# EAGLE design lens controller2 (EAGLE 6.2)
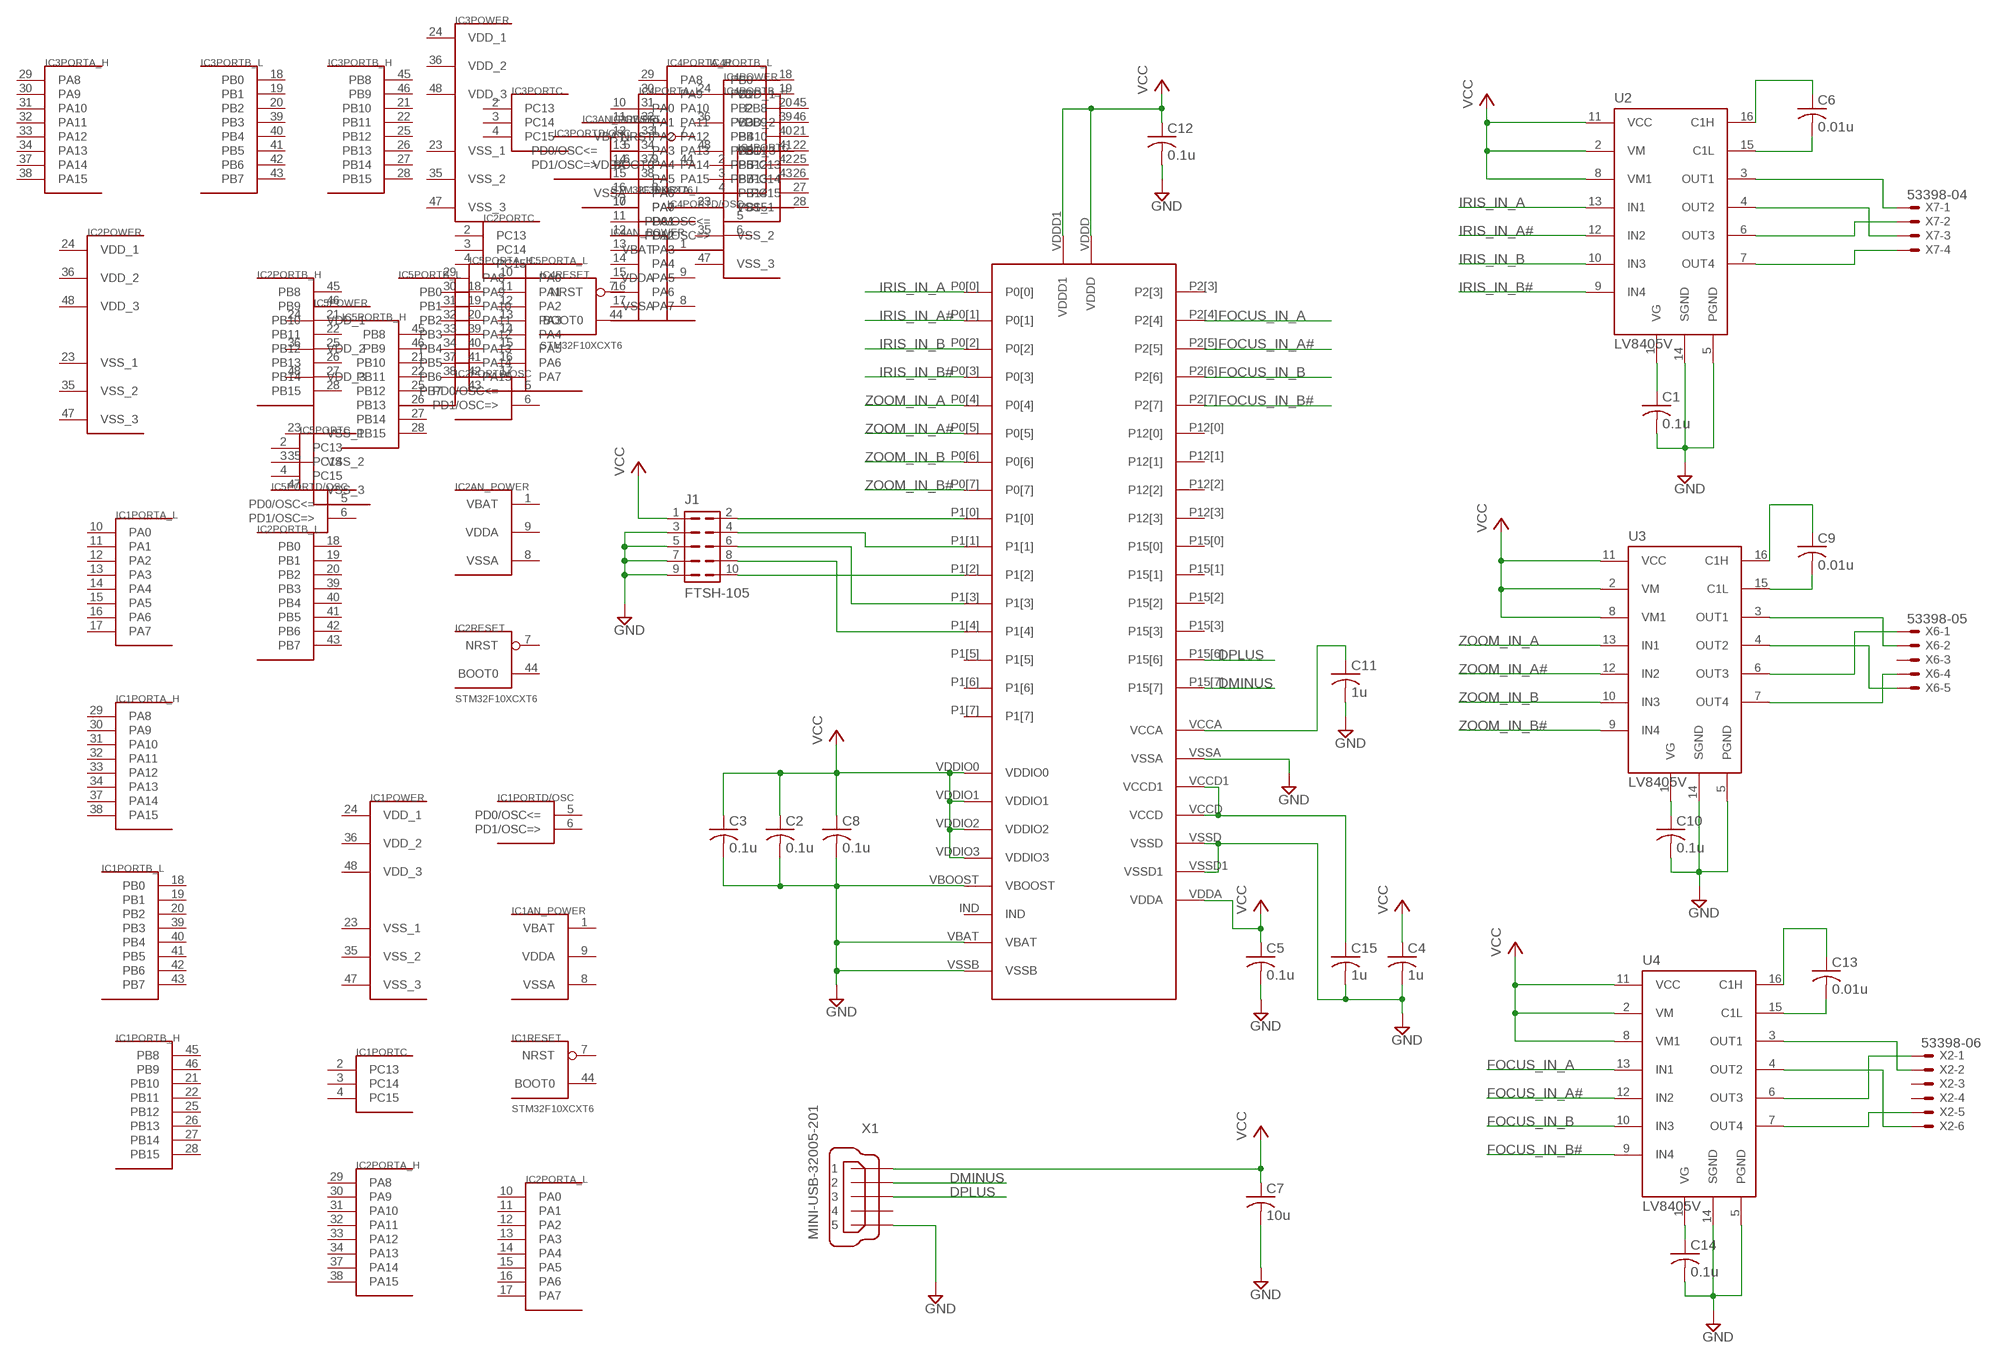
[diagram p0: schematic, sheet 1]

## Parts
C1  0.1u  C-USC1206  [C1206]
C2  0.1u  C-USC1206  [C1206]
C3  0.1u  C-USC1206  [C1206]
C4  1u  C-USC1206  [C1206]
C5  0.1u  C-USC1206  [C1206]
C6  0.01u  C-USC1206  [C1206]
C7  10u  C-USC1206  [C1206]
C8  0.1u  C-USC1206  [C1206]
C9  0.01u  C-USC1206  [C1206]
C10  0.1u  C-USC1206  [C1206]
C11  1u  C-USC1206  [C1206]
C12  0.1u  C-USC1206  [C1206]
C13  0.01u  C-USC1206  [C1206]
C14  0.1u  C-USC1206  [C1206]
C15  1u  C-USC1206  [C1206]
IC1  STM32F10XCXT6  [TQFP48]
IC2  STM32F10XCXT6  [TQFP48]
IC3  STM32F10XCXT6  [TQFP48]
IC4  STM32F10XCXT6  [TQFP48]
IC5  STM32F10XCXT6  [TQFP48]
J1  FTSH-105  [FTSH-105-01-XXX-DV-K]
U1  CY8C3XXX_48QFN  [48QFN]
U2  LV8405V  [SSOP16]
U3  LV8405V  [SSOP16]
U4  LV8405V  [SSOP16]
X1  MINI-USB-32005-201  [32005-201]
X2  53398-06  [53398-06]
X6  53398-05  [53398-05]
X7  53398-04  [53398-04]

## Nets
DMINUS: U1.P15[7] X1.2
DPLUS: U1.P15[6] X1.3
FOCUS_IN_A: U1.P2[4] U4.13(IN1)
FOCUS_IN_A#: U1.P2[5] U4.12(IN2)
FOCUS_IN_B: U1.P2[6] U4.10(IN3)
FOCUS_IN_B#: U1.P2[7] U4.9(IN4)
GND: C1.2 C2.2 C3.2 C4.2 C5.2 C7.2 C8.2 C10.2 C11.2 C12.2 C14.2 C15.2 J1.3 J1.5 J1.7 J1.9 U1.VBAT U1.VBOOST U1.VSSA U1.VSSB U1.VSSD U1.VSSD1 U2.5(PGND) U2.14(SGND) U3.5(PGND) U3.14(SGND) U4.5(PGND) U4.14(SGND) X1.5
IRIS_IN_A: U1.P0[0] U2.13(IN1)
IRIS_IN_A#: U1.P0[1] U2.12(IN2)
IRIS_IN_B: U1.P0[2] U2.10(IN3)
IRIS_IN_B#: U1.P0[3] U2.9(IN4)
N$1: J1.2 U1.P1[0]
N$2: J1.4 U1.P1[1]
N$3: J1.10 U1.P1[2]
N$4: J1.6 U1.P1[3]
N$5: J1.8 U1.P1[4]
N$6: C11.1 U1.VCCA
N$7: C6.2 U2.15(C1L)
N$8: C6.1 U2.16(C1H)
N$9: C1.1 U2.1(VG)
N$10: C9.2 U3.15(C1L)
N$11: C9.1 U3.16(C1H)
N$12: C10.1 U3.1(VG)
N$13: U2.3(OUT1) X7.1
N$14: U2.4(OUT2) X7.3
N$15: C13.2 U4.15(C1L)
N$16: C13.1 U4.16(C1H)
N$17: C14.1 U4.1(VG)
N$18: U2.6(OUT3) X7.2
N$19: U2.7(OUT4) X7.4
N$20: U3.3(OUT1) X6.2
N$21: U3.4(OUT2) X6.5
N$22: U3.6(OUT3) X6.1
N$23: U3.7(OUT4) X6.4
N$24: U4.3(OUT1) X2.2
N$25: U4.4(OUT2) X2.6
N$26: U4.6(OUT3) X2.1
N$27: U4.7(OUT4) X2.5
N$28: C15.1 U1.VCCD U1.VCCD1
N$29: IC3.10(PORTA_L:PA0) IC4.17(PORTA_L:PA7)
N$30: IC3.5(PORTD/OSC:PD0/OSC<=) IC4.34(PORTA_H:PA13)
N$31: IC3.6(PORTD/OSC:PD1/OSC=>) IC4.37(PORTA_H:PA14)
VCC: C2.1 C3.1 C4.1 C5.1 C7.1 C8.1 C12.1 J1.1 U1.VDDA U1.VDDD U1.VDDD1 U1.VDDIO0 U1.VDDIO1 U1.VDDIO2 U1.VDDIO3 U2.2(VM) U2.8(VM1) U2.11(VCC) U3.2(VM) U3.8(VM1) U3.11(VCC) U4.2(VM) U4.8(VM1) U4.11(VCC) X1.1
ZOOM_IN_A: U1.P0[4] U3.13(IN1)
ZOOM_IN_A#: U1.P0[5] U3.12(IN2)
ZOOM_IN_B: U1.P0[6] U3.10(IN3)
ZOOM_IN_B#: U1.P0[7] U3.9(IN4)
Unconnected: IC1.2(PORTC:PC13) IC1.3(PORTC:PC14) IC1.4(PORTC:PC15) IC1.5(PORTD/OSC:PD0/OSC<=) IC1.6(PORTD/OSC:PD1/OSC=>) IC1.7(RESET:NRST) IC1.10(PORTA_L:PA0) IC1.11(PORTA_L:PA1) IC1.12(PORTA_L:PA2) IC1.13(PORTA_L:PA3) IC1.14(PORTA_L:PA4) IC1.15(PORTA_L:PA5) IC1.16(PORTA_L:PA6) IC1.17(PORTA_L:PA7) IC1.18(PORTB_L:PB0) IC1.19(PORTB_L:PB1) IC1.20(PORTB_L:PB2) IC1.21(PORTB_H:PB10) IC1.22(PORTB_H:PB11) IC1.25(PORTB_H:PB12) IC1.26(PORTB_H:PB13) IC1.27(PORTB_H:PB14) IC1.28(PORTB_H:PB15) IC1.29(PORTA_H:PA8) IC1.30(PORTA_H:PA9) IC1.31(PORTA_H:PA10) IC1.32(PORTA_H:PA11) IC1.33(PORTA_H:PA12) IC1.34(PORTA_H:PA13) IC1.37(PORTA_H:PA14) IC1.38(PORTA_H:PA15) IC1.39(PORTB_L:PB3) IC1.40(PORTB_L:PB4) IC1.41(PORTB_L:PB5) IC1.42(PORTB_L:PB6) IC1.43(PORTB_L:PB7) IC1.44(RESET:BOOT0) IC1.45(PORTB_H:PB8) IC1.46(PORTB_H:PB9) IC2.2(PORTC:PC13) IC2.3(PORTC:PC14) IC2.4(PORTC:PC15) IC2.5(PORTD/OSC:PD0/OSC<=) IC2.6(PORTD/OSC:PD1/OSC=>) IC2.7(RESET:NRST) IC2.10(PORTA_L:PA0) IC2.11(PORTA_L:PA1) IC2.12(PORTA_L:PA2) IC2.13(PORTA_L:PA3) IC2.14(PORTA_L:PA4) IC2.15(PORTA_L:PA5) IC2.16(PORTA_L:PA6) IC2.17(PORTA_L:PA7) IC2.18(PORTB_L:PB0) IC2.19(PORTB_L:PB1) IC2.20(PORTB_L:PB2) IC2.21(PORTB_H:PB10) IC2.22(PORTB_H:PB11) IC2.25(PORTB_H:PB12) IC2.26(PORTB_H:PB13) IC2.27(PORTB_H:PB14) IC2.28(PORTB_H:PB15) IC2.29(PORTA_H:PA8) IC2.30(PORTA_H:PA9) IC2.31(PORTA_H:PA10) IC2.32(PORTA_H:PA11) IC2.33(PORTA_H:PA12) IC2.34(PORTA_H:PA13) IC2.37(PORTA_H:PA14) IC2.38(PORTA_H:PA15) IC2.39(PORTB_L:PB3) IC2.40(PORTB_L:PB4) IC2.41(PORTB_L:PB5) IC2.42(PORTB_L:PB6) IC2.43(PORTB_L:PB7) IC2.44(RESET:BOOT0) IC2.45(PORTB_H:PB8) IC2.46(PORTB_H:PB9) IC3.2(PORTC:PC13) IC3.3(PORTC:PC14) IC3.4(PORTC:PC15) IC3.7(RESET:NRST) IC3.11(PORTA_L:PA1) IC3.12(PORTA_L:PA2) IC3.13(PORTA_L:PA3) IC3.14(PORTA_L:PA4) IC3.15(PORTA_L:PA5) IC3.16(PORTA_L:PA6) IC3.17(PORTA_L:PA7) IC3.18(PORTB_L:PB0) IC3.19(PORTB_L:PB1) IC3.20(PORTB_L:PB2) IC3.21(PORTB_H:PB10) IC3.22(PORTB_H:PB11) IC3.25(PORTB_H:PB12) IC3.26(PORTB_H:PB13) IC3.27(PORTB_H:PB14) IC3.28(PORTB_H:PB15) IC3.29(PORTA_H:PA8) IC3.30(PORTA_H:PA9) IC3.31(PORTA_H:PA10) IC3.32(PORTA_H:PA11) IC3.33(PORTA_H:PA12) IC3.34(PORTA_H:PA13) IC3.37(PORTA_H:PA14) IC3.38(PORTA_H:PA15) IC3.39(PORTB_L:PB3) IC3.40(PORTB_L:PB4) IC3.41(PORTB_L:PB5) IC3.42(PORTB_L:PB6) IC3.43(PORTB_L:PB7) IC3.44(RESET:BOOT0) IC3.45(PORTB_H:PB8) IC3.46(PORTB_H:PB9) IC4.2(PORTC:PC13) IC4.3(PORTC:PC14) IC4.4(PORTC:PC15) IC4.5(PORTD/OSC:PD0/OSC<=) IC4.6(PORTD/OSC:PD1/OSC=>) IC4.7(RESET:NRST) IC4.10(PORTA_L:PA0) IC4.11(PORTA_L:PA1) IC4.12(PORTA_L:PA2) IC4.13(PORTA_L:PA3) IC4.14(PORTA_L:PA4) IC4.15(PORTA_L:PA5) IC4.16(PORTA_L:PA6) IC4.18(PORTB_L:PB0) IC4.19(PORTB_L:PB1) IC4.20(PORTB_L:PB2) IC4.21(PORTB_H:PB10) IC4.22(PORTB_H:PB11) IC4.25(PORTB_H:PB12) IC4.26(PORTB_H:PB13) IC4.27(PORTB_H:PB14) IC4.28(PORTB_H:PB15) IC4.29(PORTA_H:PA8) IC4.30(PORTA_H:PA9) IC4.31(PORTA_H:PA10) IC4.32(PORTA_H:PA11) IC4.33(PORTA_H:PA12) IC4.38(PORTA_H:PA15) IC4.39(PORTB_L:PB3) IC4.40(PORTB_L:PB4) IC4.41(PORTB_L:PB5) IC4.42(PORTB_L:PB6) IC4.43(PORTB_L:PB7) IC4.44(RESET:BOOT0) IC4.45(PORTB_H:PB8) IC4.46(PORTB_H:PB9) IC5.2(PORTC:PC13) IC5.3(PORTC:PC14) IC5.4(PORTC:PC15) IC5.5(PORTD/OSC:PD0/OSC<=) IC5.6(PORTD/OSC:PD1/OSC=>) IC5.7(RESET:NRST) IC5.10(PORTA_L:PA0) IC5.11(PORTA_L:PA1) IC5.12(PORTA_L:PA2) IC5.13(PORTA_L:PA3) IC5.14(PORTA_L:PA4) IC5.15(PORTA_L:PA5) IC5.16(PORTA_L:PA6) IC5.17(PORTA_L:PA7) IC5.18(PORTB_L:PB0) IC5.19(PORTB_L:PB1) IC5.20(PORTB_L:PB2) IC5.21(PORTB_H:PB10) IC5.22(PORTB_H:PB11) IC5.25(PORTB_H:PB12) IC5.26(PORTB_H:PB13) IC5.27(PORTB_H:PB14) IC5.28(PORTB_H:PB15) IC5.29(PORTA_H:PA8) IC5.30(PORTA_H:PA9) IC5.31(PORTA_H:PA10) IC5.32(PORTA_H:PA11) IC5.33(PORTA_H:PA12) IC5.34(PORTA_H:PA13) IC5.37(PORTA_H:PA14) IC5.38(PORTA_H:PA15) IC5.39(PORTB_L:PB3) IC5.40(PORTB_L:PB4) IC5.41(PORTB_L:PB5) IC5.42(PORTB_L:PB6) IC5.43(PORTB_L:PB7) IC5.44(RESET:BOOT0) IC5.45(PORTB_H:PB8) IC5.46(PORTB_H:PB9) U1.IND U1.P1[5] U1.P1[6] U1.P1[7] U1.P2[3] U1.P12[0] U1.P12[1] U1.P12[2] U1.P12[3] U1.P15[0] U1.P15[1] U1.P15[2] U1.P15[3] X1.4 X2.3 X2.4 X6.3

## Power pins joined to a net without a drawn wire
VBAT: IC1.1(AN_POWER:VBAT) IC2.1(AN_POWER:VBAT) IC3.1(AN_POWER:VBAT) IC4.1(AN_POWER:VBAT) IC5.1(AN_POWER:VBAT)
VDD_1: IC1.24(POWER:VDD_1) IC2.24(POWER:VDD_1) IC3.24(POWER:VDD_1) IC4.24(POWER:VDD_1) IC5.24(POWER:VDD_1)
VDD_2: IC1.36(POWER:VDD_2) IC2.36(POWER:VDD_2) IC3.36(POWER:VDD_2) IC4.36(POWER:VDD_2) IC5.36(POWER:VDD_2)
VDD_3: IC1.48(POWER:VDD_3) IC2.48(POWER:VDD_3) IC3.48(POWER:VDD_3) IC4.48(POWER:VDD_3) IC5.48(POWER:VDD_3)
VDDA: IC1.9(AN_POWER:VDDA) IC2.9(AN_POWER:VDDA) IC3.9(AN_POWER:VDDA) IC4.9(AN_POWER:VDDA) IC5.9(AN_POWER:VDDA)
VSS_1: IC1.23(POWER:VSS_1) IC2.23(POWER:VSS_1) IC3.23(POWER:VSS_1) IC4.23(POWER:VSS_1) IC5.23(POWER:VSS_1)
VSS_2: IC1.35(POWER:VSS_2) IC2.35(POWER:VSS_2) IC3.35(POWER:VSS_2) IC4.35(POWER:VSS_2) IC5.35(POWER:VSS_2)
VSS_3: IC1.47(POWER:VSS_3) IC2.47(POWER:VSS_3) IC3.47(POWER:VSS_3) IC4.47(POWER:VSS_3) IC5.47(POWER:VSS_3)
VSSA: IC1.8(AN_POWER:VSSA) IC2.8(AN_POWER:VSSA) IC3.8(AN_POWER:VSSA) IC4.8(AN_POWER:VSSA) IC5.8(AN_POWER:VSSA)

## Library data of the parts
C1-C15 = resistor:C-US: CAPACITOR, American symbol
IC1-IC5 = stm32:STM32F10XCXT6: ST STM32F101/103 48pin LQFP
J1 = NicksParts:FTSH-105
U1 = NicksParts:CY8C3XXX_48QFN
U2-U4 = NicksParts:LV8405V
X1 = con-cypressindustries:MINI-USB-: MINI USB-B Conector Source: www.cypressindustries.com; OC_FARNELL: unknown; OC_NEWARK: unknown
X2 = con-molex:53?-06: CONNECTOR wire to board 1.25 mm (.049 inch) pitch header; OC_FARNELL: 1125368; OC_NEWARK: unknown
X6 = con-molex:53?-05: CONNECTOR wire to board 1.25 mm (.049 inch) pitch header; OC_FARNELL: 1125354; OC_NEWARK: unknown
X7 = con-molex:53?-04: CONNECTOR wire to board 1.25 mm (.049 inch) pitch header; OC_FARNELL: 1125367; OC_NEWARK: unknown

## Board
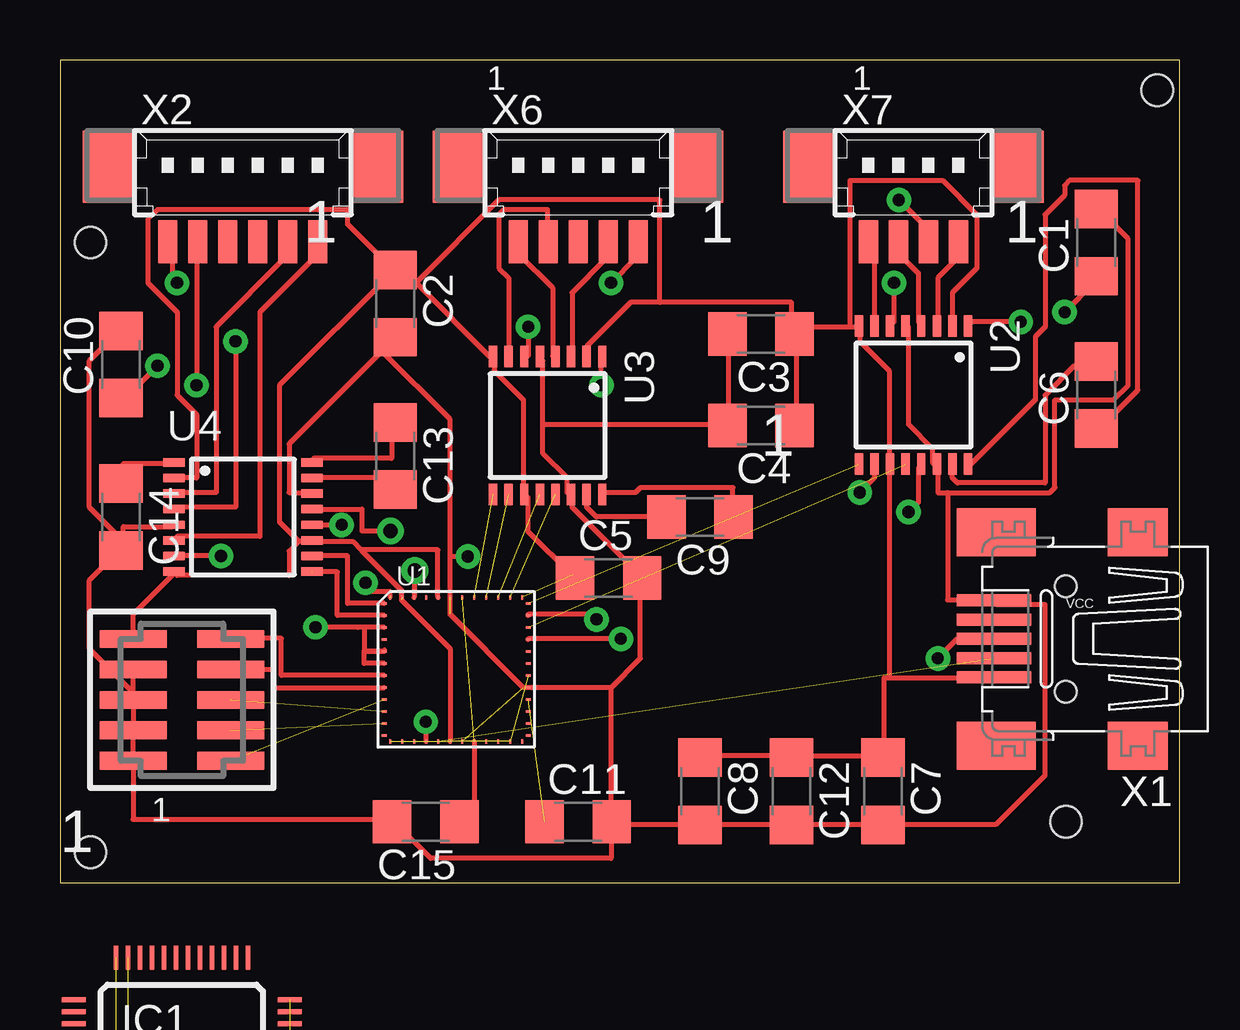
[diagram p1: board, top side]
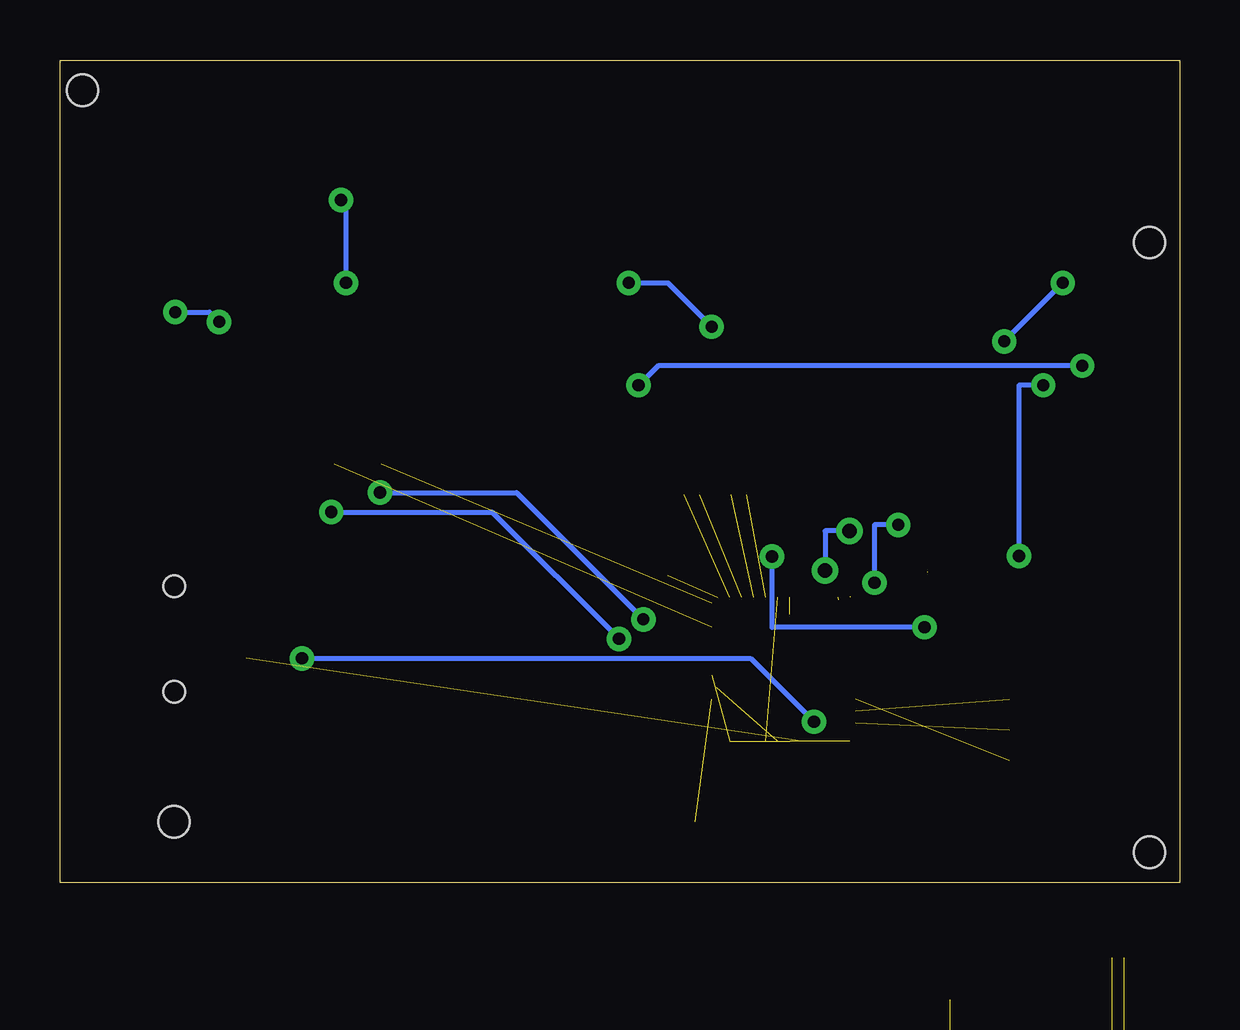
[diagram p2: board, bottom side, seen from below]

Size 46.66 x 34.28 mm. Coordinates in mm from the lower left corner, seen from the top.
Outline: 0,0 46.66,0 46.66,34.28 0,34.28 0,0
Copper layers (1*16): Top 0.035mm / dielectric 1.5mm / Bottom 0.035mm
Design rules: minimum track width 8mil, minimum drill 20mil, track to track 8mil, track to pad 8mil, pad to pad 8mil, via to via 8mil, smd to smd 8mil, copper to edge 10mil, drill to drill 8mil, minimum pad ring 12mil, minimum via ring 10mil, stop-mask expansion 4mil, vias tented up to drill 25mil, thermal gap 10mil
Holes 1.3 mm at 1.27,26.67 45.72,33.02 41.91,2.54 1.27,1.27

### Footprints (pad centres in the part's own frame; a part is rotated, then mirrored left to right if it is on the bottom)
C1206 = smd 1.6 x 1.8: 1 -1.4,0; 2 1.4,0
TQFP48 = smd 0.2 x 1: 1 -2.75,-4.5; 2 -2.25,-4.5; 3 -1.75,-4.5; 4 -1.25,-4.5; 5 -0.75,-4.5; 6 -0.25,-4.5; 7 0.25,-4.5; 8 0.75,-4.5; 9 1.25,-4.5; 10 1.75,-4.5; 11 2.25,-4.5; 12 2.75,-4.5; 25 2.75,4.5; 26 2.25,4.5; 27 1.75,4.5; 28 1.25,4.5; 29 0.75,4.5; 30 0.25,4.5; 31 -0.25,4.5; 32 -0.75,4.5; 33 -1.25,4.5; 34 -1.75,4.5; 35 -2.25,4.5; 36 -2.75,4.5 | smd 1 x 0.2: 13 4.5,-2.75; 14 4.5,-2.25; 15 4.5,-1.75; 16 4.5,-1.25; 17 4.5,-0.75; 18 4.5,-0.25; 19 4.5,0.25; 20 4.5,0.75; 21 4.5,1.25; 22 4.5,1.75; 23 4.5,2.25; 24 4.5,2.75; 37 -4.5,2.75; 38 -4.5,2.25; 39 -4.5,1.75; 40 -4.5,1.25; 41 -4.5,0.75; 42 -4.5,0.25; 43 -4.5,-0.25; 44 -4.5,-0.75; 45 -4.5,-1.25; 46 -4.5,-1.75; 47 -4.5,-2.25; 48 -4.5,-2.75
FTSH-105-01-XXX-DV-K = smd 0.737 x 2.794: 1 -2.54,-2.032; 2 -2.54,2.032; 3 -1.27,-2.032; 4 -1.27,2.032; 5 0,-2.032; 6 0,2.032; 7 1.27,-2.032; 8 1.27,2.032; 9 2.54,-2.032; 10 2.54,2.032
48QFN = smd 0.19 x 0.1: IND -3,1.25; P0[0] 3,1.25; P0[1] 3,1.75; P0[2] 3,2.25; P0[3] 3,2.75; P1[0] -3,-0.25; P1[1] -3,-0.75; P1[2] -3,-1.25; P1[3] -3,-1.75; P1[4] -3,-2.25; P1[5] -3,-2.75; P2[6] -3,2.75; P2[7] -3,2.25; P12[1] 3,-2.75; P12[2] 3,0.25; P12[3] 3,0.75; P15[2] 3,-2.25; P15[3] 3,-1.75; VBAT -3,0.25; VBOOST -3,0.75; VCCA 3,-1.25; VDDA 3,-0.25; VSSA 3,-0.75; VSSB -3,1.75 | smd 0.1 x 0.19: P0[4] 2.25,3; P0[5] 1.75,3; P0[6] 1.25,3; P0[7] 0.75,3; P1[6] -2.25,-3; P1[7] -1.75,-3; P2[3] -1.25,3; P2[4] -1.75,3; P2[5] -2.75,3; P12[0] 2.75,-3; P15[0] 1.25,-3; P15[1] 1.75,-3; P15[6] -1.25,-3; P15[7] -0.75,-3; VCCD 0.75,-3; VCCD1 0.25,3; VDDD -0.25,-3; VDDD1 -0.75,3; VDDIO0 2.75,3; VDDIO1 -2.75,-3; VDDIO2 -2.25,3; VDDIO3 2.25,-3; VSSD 0.25,-3; VSSD1 -0.25,3
SSOP16 = smd 0.9 x 0.35: 1 -2.875,2.275; 2 -2.875,1.625; 3 -2.875,0.975; 4 -2.875,0.325; 5 -2.875,-0.325; 6 -2.875,-0.975; 7 -2.875,-1.625; 8 -2.875,-2.275; 9 2.875,-2.275; 10 2.875,-1.625; 11 2.875,-0.975; 12 2.875,-0.325; 13 2.875,0.325; 14 2.875,0.975; 15 2.875,1.625; 16 2.875,2.275
32005-201 = smd 3.1 x 0.5: 1 3,1.6; 2 3,0.8; 3 3,0; 4 3,-0.8; 5 3,-1.6 | smd 2.5 x 2: M1 -3,-4.45; M2 -3,4.45 | smd 3.3 x 2: M3 2.9,4.45; M4 2.9,-4.45 | hole 0.9: 0,2.2; 0,-2.2
53398-06 = smd 0.8 x 1.8: 1 3.125,-2.5; 2 1.875,-2.5; 3 0.625,-2.5; 4 -0.625,-2.5; 5 -1.875,-2.5; 6 -3.125,-2.5 | smd 2.1 x 3: S1 5.625,0.625; S2 -5.625,0.625
53398-05 = smd 0.8 x 1.8: 1 2.5,-2.5; 2 1.25,-2.5; 3 0,-2.5; 4 -1.25,-2.5; 5 -2.5,-2.5 | smd 2.1 x 3: S1 5,0.625; S2 -5,0.625
53398-04 = smd 0.8 x 1.8: 1 1.875,-2.5; 2 0.625,-2.5; 3 -0.625,-2.5; 4 -1.875,-2.5 | smd 2.1 x 3: S1 4.375,0.625; S2 -4.375,0.625

### Placement (x,y rotation side)
C1  43.18,26.67 90 top
C2  13.97,24.13 270 top
C3  29.21,22.86 180 top
C4  29.21,19.05 180 top
C5  22.86,12.7 0 top
C6  43.18,20.32 90 top
C7  34.29,3.81 270 top
C8  26.67,3.81 270 top
C9  26.67,15.24 180 top
C10  2.54,21.59 90 top
C11  21.59,2.54 0 top
C12  30.48,3.81 270 top
C13  13.97,17.78 270 top
C14  2.54,15.24 270 top
C15  15.24,2.54 180 top
IC1  5.08,-7.62 0 top  (outside the outline)
IC2  5.08,-20.32 0 top  (outside the outline)
IC3  5.08,-33.02 0 top  (outside the outline)
IC4  5.08,-45.72 0 top  (outside the outline)
IC5  5.08,-58.42 0 top  (outside the outline)
J1  5.08,7.62 270 top
U1  16.51,8.89 0 top
U2  35.56,20.32 270 top
U3  20.32,19.05 270 top
U4  7.62,15.24 0 top
X1  41.91,10.16 180 top
X2  7.62,29.21 0 top
X6  21.59,29.21 0 top
X7  35.56,29.21 0 top

### Tracks (layer width: path | path; a pad name or v marks a point on that pad's centre or on a via)
DMINUS  (1 unrouted)
DPLUS  (via drill 0.51)
  Top 0.203: v15.24,6.71 15.24,5.89 U1.P15[6] | v36.58,9.35 37.39,10.16 38.81,10.16 X1.3
  Bottom 0.203: v15.24,6.71 17.88,9.35 v36.58,9.35
FOCUS_IN_A  (via drill 0.6)
  Top 0.203: U4.13 12.57,15.56 12.57,15.11 12.57,14.66 v13.77,14.66 | v14.78,13.01 14.76,13.01 U1.P2[4]
  Bottom 0.203: v13.77,14.66 14.78,14.66 v14.78,13.01
FOCUS_IN_A#  (via drill 0.51 pad 0.81)  (1 unrouted)
  Top 0.203: U4.12 v11.73,14.91 | v12.72,12.5 12.8,12.5 12.8,12.14 13.74,12.14 13.74,11.91
  Bottom 0.203: v11.73,14.91 12.72,14.91 v12.72,12.5
FOCUS_IN_B
  Top 0.203: U1.P2[6] 11.99,11.64 11.99,13.61 U4.10
FOCUS_IN_B#  (1 unrouted)
  Top 0.203: U1.P2[7] 11.56,11.14 11.56,12.95 10.52,12.95
GND  (via drill 0.51 pad 0.81)  (2 unrouted)
  Top 0.203: 2.64,14.22 2.64,14.02 C14.2 | 2.64,14.22 2.64,14.83 4.67,14.83 U4.5 | 2.64,14.22 1.22,15.65 1.22,21.74 2.44,22.96 C10.2 | 2.64,14.22 C14.2 | J1.5 3.05,7.52 3.05,6.5 J1.7 3.05,6.3 J1.9 3.05,2.64 13.82,2.64 C15.2 14.02,2.44 15.44,1.02 22.96,1.02 22.96,2.44 C11.2 | 3.05,7.92 3.05,7.72 J1.5 | 3.05,7.92 3.05,8.74 J1.3 | 3.05,7.92 1.22,9.75 1.22,12.6 2.44,13.82 C14.2 | 3.05,7.92 J1.5 | U2.5 35.36,23.16 35.36,19.1 36.37,18.09 36.37,17.48 U2.14 36.58,17.27 36.58,16.26 36.98,16.26 | 36.98,16.26 41.25,16.26 41.45,16.46 41.45,20.12 43.89,20.12 44.5,20.73 44.5,26.82 43.28,28.04 C1.2 | 36.98,16.26 36.98,11.79 38.81,11.79 X1.5 39.01,11.58 41.05,11.58 41.05,4.47 39.01,2.44 34.34,2.44 C7.2 34.14,2.44 30.48,2.44 | C3.2 27.84,22.76 27.84,19.1 C4.2 27.64,19.1 20.12,19.1 | 20.12,19.1 20.12,17.88 21.13,16.87 21.13,16.26 U3.14 21.34,16.05 21.34,15.65 24.18,12.8 C5.2 24.18,12.6 24.18,9.35 22.96,8.13 | 20.12,19.1 20.12,21.74 U3.5 | 13.41,22.15 13.82,22.55 C2.2 13.41,22.15 | 13.41,22.15 9.55,18.29 9.55,16.26 10.36,16.26 U4.14 | 22.96,8.13 19.51,8.13 | 22.96,8.13 22.96,2.64 C11.2 | 19.51,8.13 U1.VSSA 19.51,8.13 | C11.2 23.16,2.44 26.62,2.44 C8.2 26.82,2.44 30.48,2.44 | 30.48,2.44 C12.2 30.48,2.44 | 13.41,22.15 16.26,19.3 16.26,13.59 | 16.26,13.59 16.26,11.18 19.3,8.13 19.51,8.13 | v10.64,10.64 12.42,10.64 U1.VSSB 12.68,10.64 12.68,9.65 | v16.99,13.59 16.26,13.59 | U1.VBAT 12.68,9.14 12.68,9.65 | 12.68,9.65 12.72,9.65 | 12.72,9.65 13.51,9.65 13.51,9.7 | U1.VBOOST 12.72,9.64 12.72,9.65
  Bottom 0.203: v10.64,10.64 16.99,10.64 v16.99,13.59
IRIS_IN_A  (via drill 0.51)
  Top 0.203: v23.37,10.16 19.51,10.16 U1.P0[0] | v35.36,15.44 35.76,15.85 35.76,17.27 U2.13
  Bottom 0.203: v23.37,10.16 28.65,15.44 v35.36,15.44
IRIS_IN_A#  (1 unrouted)
IRIS_IN_B  (via drill 0.51)
  Top 0.203: v22.35,10.97 22.35,11.18 19.51,11.18 U1.P0[2] | v33.33,16.26 33.93,16.87 33.93,17.27 U2.10
  Bottom 0.203: v22.35,10.97 27.64,16.26 v33.33,16.26
IRIS_IN_B#  (1 unrouted)
N$1
  Top 0.203: U1.P1[0] 9.22,8.64 9.22,10.19 7.11,10.19 J1.2
N$2
  Top 0.203: J1.4 8.89,8.89 8.89,8.13 13.51,8.13 U1.P1[1]
N$3  (1 unrouted)
N$4  (1 unrouted)
N$5  (1 unrouted)
N$6  (1 unrouted)
N$7
  Top 0.203: U2.15 37.19,17.27 37.19,16.87 37.39,16.66 41.05,16.66 41.05,20.32 42.27,21.54 43.08,21.54 C6.2
N$8
  Top 0.203: U2.16 38,17.48 40.64,20.12 40.64,22.76 41.05,23.16 41.05,27.84 41.86,28.65 41.86,29.06 42.06,29.26 44.91,29.26 44.91,20.52 43.28,18.9 C6.1
N$9  (via drill 0.51)
  Top 0.203: v40.03,23.37 38,23.37 U2.1 | v41.86,23.77 43.08,24.99 43.08,25.2 C1.1
  Bottom 0.203: v40.03,23.37 40.44,23.77 v41.86,23.77
N$10
  Top 0.203: U3.15 21.95,16.05 21.95,15.65 22.35,15.24 25.2,15.24 C9.2
N$11
  Top 0.203: U3.16 22.76,16.26 23.98,16.26 24.18,16.46 28.04,16.46 28.04,15.24 C9.1
N$12  (via drill 0.51)
  Top 0.203: v22.55,20.73 22.55,21.74 U3.1 | v4.06,21.54 2.64,20.12 C10.1
  Bottom 0.203: v22.55,20.73 21.74,21.54 v4.06,21.54
N$13
  Top 0.203: U2.3 36.58,23.37 36.58,25.2 37.39,26.01 37.39,26.62 X7.1
N$14
  Top 0.203: U2.4 35.76,23.37 35.76,25.4 34.95,26.21 34.95,26.62 X7.3
N$15
  Top 0.203: U4.15 10.57,16.87 13.82,16.87 13.82,16.46 C13.2
N$16
  Top 0.203: U4.16 10.57,17.68 13.82,17.68 13.82,19.1 C13.1
N$17
  Top 0.203: U4.1 4.67,17.48 2.64,17.48 2.64,16.66 C14.1
N$18  (via drill 0.51)
  Top 0.203: v34.75,24.99 34.75,23.37 U2.6 | v34.95,28.45 36.17,27.23 36.17,26.82 X7.2
  Bottom 0.203: v34.75,24.99 34.75,28.45 v34.95,28.45
N$19
  Top 0.203: U2.7 33.93,23.37 33.93,26.42 33.73,26.62 X7.4
N$20
  Top 0.203: U3.3 21.34,21.95 21.34,24.59 22.76,26.01 22.76,26.62 X6.2
N$21
  Top 0.203: U3.4 20.52,21.95 20.52,24.79 19.1,26.21 19.1,26.62 X6.5
N$22  (via drill 0.51)
  Top 0.203: v19.51,23.16 19.51,21.95 U3.6 | v22.96,24.99 23.98,26.01 23.98,26.62 X6.1
  Bottom 0.203: v19.51,23.16 21.34,24.99 v22.96,24.99
N$23
  Top 0.203: U3.7 18.69,21.95 18.69,25.2 18.29,25.6 18.29,27.84 18.49,28.04 20.32,28.04 20.32,26.82 X6.4
N$24
  Top 0.203: U4.3 4.88,16.26 6.5,16.26 6.5,23.16 9.35,26.01 9.35,26.62 X2.2
N$25  (via drill 0.51)
  Top 0.203: v7.32,22.55 7.32,15.65 4.88,15.65 U4.4 | v4.88,24.99 4.67,25.2 4.67,26.62 X2.6
  Bottom 0.203: v4.88,24.99 v7.32,22.55
N$26
  Top 0.203: U4.6 4.88,14.43 8.33,14.43 8.33,23.77 10.57,26.01 10.57,26.62 X2.1
N$27  (via drill 0.51)
  Top 0.203: v6.71,13.61 4.88,13.61 U4.7 | v5.69,20.73 5.69,26.62 X2.5
  Bottom 0.203: v6.71,13.61 6.71,20.73 v5.69,20.73
N$28  (1 unrouted)
  Top 0.203: U1.VCCD 17.27,5.89 17.27,3.25 16.66,2.64 C15.1
N$29  (1 unrouted)
N$30  (1 unrouted)
N$31  (1 unrouted)
VBAT  (4 unrouted)
VCC  (5 unrouted)
  Top 0.203: J1.1 3.05,11.18 4.67,12.8 U4.8 4.88,12.8 9.55,12.8 9.55,13.82 9.96,14.22 | 12.56,13.86 12.19,14.22 10.57,14.22 U4.11 10.36,14.22 9.96,14.22 | 12.56,13.86 14.22,12.19 14.22,11.79 16.26,9.75 U1.VDDD | C5.1 21.34,12.8 19.51,14.63 19.51,16.05 U3.11 19.3,16.26 19.3,20.12 18.09,21.34 18.09,21.74 U3.8 17.88,21.95 14.83,24.99 | U4.2 4.88,16.87 5.69,16.87 5.69,19.51 4.88,20.32 4.88,23.77 3.66,24.99 3.66,27.64 4.06,28.04 11.99,28.04 11.99,27.43 13.82,25.6 C2.1 | 14.83,24.99 14.43,25.4 14.02,25.4 C2.1 | 9.96,14.22 9.14,15.04 9.14,20.73 13.82,25.4 C2.1 | 30.48,5.28 26.82,5.28 C8.1 | 30.48,5.28 C12.1 30.48,5.28 | 30.48,5.28 34.14,5.28 C7.1 34.34,5.28 34.34,8.53 34.54,8.53 | 34.54,8.53 38.81,8.53 X1.1 | 24.99,24.18 30.48,24.18 30.48,23.16 | 24.99,24.18 23.77,24.18 21.95,22.35 21.95,21.95 U3.2 | 30.48,23.16 30.48,22.96 C3.1 | 30.48,23.16 32.92,23.16 | 32.92,23.16 33.12,23.16 U2.8 33.33,23.16 33.33,22.55 34.54,21.34 34.54,17.48 U2.11 34.54,17.27 34.54,8.53 | 30.48,23.16 C3.1 | 32.92,23.16 32.92,29.26 36.78,29.26 38.2,27.84 38.2,25.6 37.19,24.59 37.19,23.37 U2.2 | C4.1 30.68,19.1 30.68,22.76 C3.1 | 14.83,24.99 18.29,28.45 24.99,28.45 24.99,24.18 | 14.83,24.99 C2.1 | U1.VDDD1 15.75,11.89 15.75,13.87 12.56,13.87 12.56,13.86
VDD_1  (4 unrouted)
VDD_2  (4 unrouted)
VDD_3  (4 unrouted)
VDDA  (4 unrouted)
VSS_1  (4 unrouted)
VSS_2  (4 unrouted)
VSS_3  (4 unrouted)
VSSA  (4 unrouted)
ZOOM_IN_A  (1 unrouted)
ZOOM_IN_A#  (1 unrouted)
ZOOM_IN_B  (1 unrouted)
ZOOM_IN_B#  (1 unrouted)

### Text on the board
tNames: 1 | 1 | 1 | 1 | 1 | 1 | VCC | 1 | 1